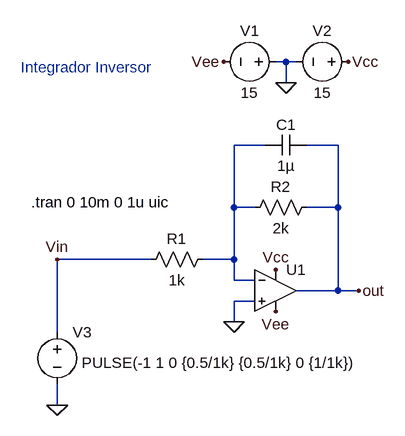
[diagram p0: schematic 4 - Integrador Inversor Entrada Triangular.asc]
4 - Integrador Inversor Entrada Triangular.asc, the LTspice schematic file:
Version 4
SHEET 1 880 680
WIRE 240 -128 224 -128
WIRE 256 -128 240 -128
WIRE 240 -96 240 -128
WIRE 208 0 160 0
WIRE 320 0 272 0
WIRE 160 96 160 0
WIRE 192 96 160 96
WIRE 320 96 320 0
WIRE 320 96 272 96
WIRE 32 176 -112 176
WIRE 160 176 160 96
WIRE 160 176 112 176
WIRE 160 208 160 176
WIRE 192 208 160 208
WIRE 320 224 320 96
WIRE 320 224 256 224
WIRE 352 224 320 224
WIRE 192 240 160 240
WIRE 160 272 160 240
WIRE -112 288 -112 176
WIRE -112 400 -112 368
FLAG 240 -96 0
FLAG 144 -128 Vee
FLAG 336 -128 Vcc
FLAG 224 192 Vcc
FLAG 224 256 Vee
FLAG 160 272 0
FLAG -112 400 0
FLAG -112 176 Vin
FLAG 352 224 out
SYMBOL voltage 240 -128 R90
WINDOW 0 -32 56 VBottom 2
WINDOW 3 32 56 VTop 2
WINDOW 123 0 0 Left 0
WINDOW 39 0 0 Left 0
SYMATTR InstName V1
SYMATTR Value 15
SYMBOL voltage 352 -128 R90
WINDOW 0 -32 56 VBottom 2
WINDOW 3 32 56 VTop 2
WINDOW 123 0 0 Left 0
WINDOW 39 0 0 Left 0
SYMATTR InstName V2
SYMATTR Value 15
SYMBOL res 288 80 R90
WINDOW 0 0 56 VBottom 2
WINDOW 3 32 56 VTop 2
SYMATTR InstName R2
SYMATTR Value 2k
SYMBOL res 128 160 R90
WINDOW 0 0 56 VBottom 2
WINDOW 3 32 56 VTop 2
SYMATTR InstName R1
SYMATTR Value 1k
SYMBOL voltage -112 272 R0
WINDOW 39 0 0 Left 0
WINDOW 3 38 63 Left 2
SYMATTR Value2 AC 1 0
SYMATTR InstName V3
SYMATTR Value PULSE(-1 1 0 {0.5/1k} {0.5/1k} 0 {1/1k})
SYMBOL OpAmps\\UniversalOpAmp2 224 224 R0
SYMATTR InstName U1
SYMBOL cap 272 -16 R90
WINDOW 0 0 32 VBottom 2
WINDOW 3 32 32 VTop 2
SYMATTR InstName C1
SYMATTR Value 1µ
TEXT -168 -120 Left 2 ;Integrador Inversor
TEXT -152 88 Left 2 !.tran 0 10m 0 1u uic

The netlist it stands for:
* 4 - Integrador Inversor Entrada Triangular.asc
V1 0 Vee 15
V2 Vcc 0 15
R2 out N001 2k
R1 N001 Vin 1k
V3 Vin 0 PULSE(-1 1 0 {0.5/1k} {0.5/1k} 0 {1/1k}) AC 1 0
XU1 0 N001 Vcc Vee out level2 Avol=1Meg GBW=10Meg Slew=10Meg Ilimit=25m Rail=0 Vos=0 En=0 Enk=0 In=0 Ink=0 Rin=500Meg  ; pins In+ In- V+ V- OUT
C1 out N001 1µ
* Integrador Inversor
.tran 0 10m 0 1u uic
.lib UniversalOpAmp2.lib
.backanno
.end